# Altium schematic sheet Opioid - Power - rev.A0.SchDoc
size A4
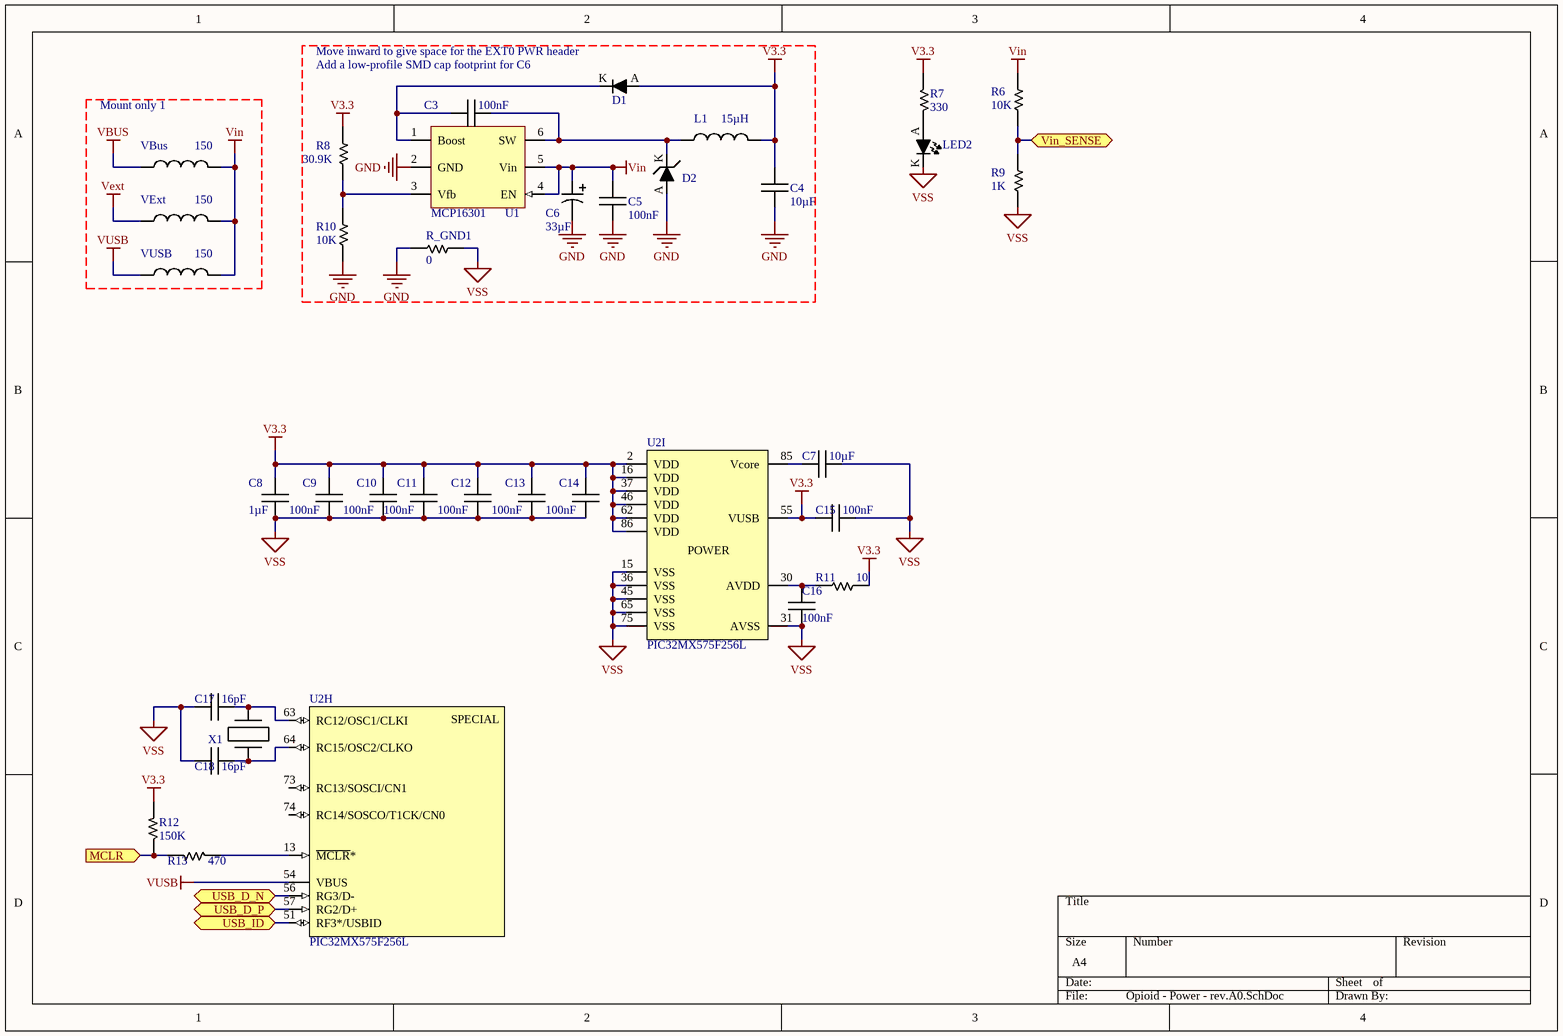
[diagram p0: Opioid - Power - rev.A0.SchDoc]

## Parts
C3  100nF  [CAPC1608N]
C4  10µF  [CAPC2012N]
C5  100nF  [CAPC1608N]
C6  33µF  [CAPPR2-5x11]
C7  10µF  [CAPC2012N]
C8  1µF  [CAPC1608N]
C9  100nF  [CAPC1608N]
C10  100nF  [CAPC1608N]
C11  100nF  [CAPC1608N]
C12  100nF  [CAPC1608N]
C13  100nF  [CAPC1608N]
C14  100nF  [CAPC1608N]
C15  100nF  [CAPC1608N]
C16  100nF  [CAPC1608N]
C17  16pF  [CAPC2012N]
C18  16pF  [CAPC2012N]
D1  Diode  [SOT323]  (value not drawn)
D2  Schottky Diode  [DO-214AC]  (value not drawn)
L1  15µH  [INDUCTOR 6×6mm Taiyo Yuden]
LED2  (no value)  [LED 1608m]
R6  10K  [RESC1608N]
R7  330  [RESC1608N]
R8  30.9K  [RESC1608N]
R9  1K  [RESC1608N]
R10  10K  [RESC1608N]
R11  10  [RESC1608N]
R12  150K  [RESC1608N]
R13  470  [RESC1608N]
R_GND1  0  [RESC1608N]
U1  MCP16301  [SOT23-6_N]
U2  PIC32MX575F256L  [TQFP-PT100_N]  (parts H,I of 9)
VBus  150  [INDC1608N]
VExt  150  [INDC1608N]
VUSB  150  [INDC1608N]
X1  Crystal  [BCY-W2/D3.1]  (value not drawn)

## Ports
MCLR (in), USB_D_N (bidir), USB_D_P (bidir), USB_ID (bidir), Vin_SENSE (bidir)

## Nets
GND: C4.1 C5.2 C6.2 D2.A(Anode) R10.1 R_GND1.1 U1.2(GND)
V3.3: C4.2 C8.2 C9.2 C10.2 C11.2 C12.2 C13.2 C14.2 C15.2 D1.A L1.2 R7.1 R8.2 R11.2 R12.2 U2.2(VDD) U2.16(VDD) U2.37(VDD) U2.46(VDD) U2.55(VUSB) U2.62(VDD) U2.86(VDD)
VBUS: VBus.1
Vext: VExt.1
Vin: C5.1 C6.1 R6.2 U1.4(EN) U1.5(Vin) VBus.2 VExt.2 VUSB.2
VSS: C7.1 C8.1 C9.1 C10.1 C11.1 C12.1 C13.1 C14.1 C15.1 C16.1 C17.2 C18.2 LED2.K R9.1 R_GND1.2 U2.15(VSS) U2.31(AVSS) U2.36(VSS) U2.45(VSS) U2.65(VSS) U2.75(VSS)
VUSB: U2.54(VBUS) VUSB.1
MCLR: R12.1 R13.2 ; port MCLR
USB_D_N: U2.56(RG3/D-) ; port USB_D_N
USB_D_P: U2.57(RG2/D+) ; port USB_D_P
USB_ID: U2.51(RF3*/USBID) ; port USB_ID
Vin_SENSE: R6.1 R9.2 ; port Vin_SENSE
NetC3_1: C3.1 D2.K(Kathode) L1.1 U1.6(SW)
NetC3_2: C3.2 D1.K U1.1(Boost)
NetC7_2: C7.2 U2.85(Vcore)
NetC16_2: C16.2 R11.1 U2.30(AVDD)
NetC17_1: C17.1 U2.63(RC12/OSC1/CLKI) X1.2
NetC18_1: C18.1 U2.64(RC15/OSC2/CLKO) X1.1
NetLED2_A: LED2.A R7.2
NetR8_1: R8.1 R10.2 U1.3(Vfb)
NetR13_1: R13.1 U2.13(~{MCLR}*)

Not connected (* = marked no-connect by the designer): U2 73(RC13/SOSCI/CN1) 74(RC14/SOSCO/T1CK/CN0)

## Notes on the sheet
- Mount only 1
- (near D1) Move inward to give space for the EXT0 PWR header
- Add a low-profile SMD cap footprint for C6
- (in symbol PIC32MX575F256L, part H) SPECIAL
- (in symbol PIC32MX575F256L, part I) POWER

## Library data of the parts
C3 C5 = Capacitor: Voltage Rating: 50V; Value: 100nF
C4 C7-C18 = Capacitor
  C4 C7: Value: 10µF
  C8: Value: 1µF
  C9-C16: Value: 100nF
  C17 C18: Value: 16pF
C6 = Capacitor Polarised: Voltage Rating: 50V; Value: 33µF
D1 = Diode: pin to pad: A>1 K>3; Model: M1MA141KT1G
D2 = Schottky Diode: Model: SS14
L1 VBus VExt VUSB = Inductor
  L1: Value: 15µH
  VBus VExt VUSB: Value: 150
LED2 = LED: pin to pad: A>1 K>2
R6-R13 R_GND1 = Resistor
  R6 R10: Value: 10K
  R7: Value: 330
  R8: Value: 30.9K
  R9: Value: 1K
  R11: Value: 10
  R12: Value: 150K
  R13: Value: 470
  R_GND1: Value: 0
X1 = Crystal: Frequency: 16MHz; Precision: 100ppm; Stability: 100ppm
U1 = MCP16301: Vout: *